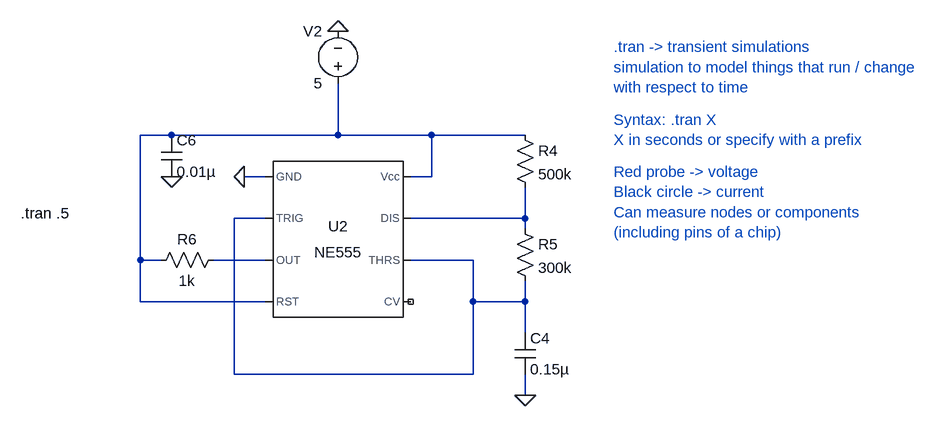
[diagram p0: schematic LTSPICE_Lesson4_Trans.asc]
LTSPICE_Lesson4_Trans.asc, the LTspice schematic file:
Version 4
SHEET 1 1600 680
WIRE -928 0 -976 0
WIRE -672 0 -672 -80
WIRE -672 0 -928 0
WIRE -528 0 -672 0
WIRE -384 0 -528 0
WIRE -784 64 -816 64
WIRE -528 64 -528 0
WIRE -528 64 -560 64
WIRE -784 128 -832 128
WIRE -384 128 -384 80
WIRE -384 128 -560 128
WIRE -384 144 -384 128
WIRE -976 192 -976 0
WIRE -944 192 -976 192
WIRE -784 192 -864 192
WIRE -464 192 -560 192
WIRE -976 256 -976 192
WIRE -784 256 -976 256
WIRE -464 256 -464 192
WIRE -384 256 -384 224
WIRE -384 256 -464 256
WIRE -384 304 -384 256
WIRE -832 368 -832 128
WIRE -464 368 -464 256
WIRE -464 368 -832 368
WIRE -384 400 -384 368
FLAG -816 64 0
FLAG -672 -160 0
FLAG -384 400 0
FLAG -928 64 0
SYMBOL Misc\\NE555 -672 160 R0
SYMATTR InstName U2
SYMBOL res -400 -16 R0
SYMATTR InstName R4
SYMATTR Value 500k
SYMBOL res -400 128 R0
SYMATTR InstName R5
SYMATTR Value 300k
SYMBOL res -848 176 R90
WINDOW 0 0 56 VBottom 2
WINDOW 3 32 56 VTop 2
SYMATTR InstName R6
SYMATTR Value 1k
SYMBOL cap -400 304 R0
SYMATTR InstName C4
SYMATTR Value 0.15µ
SYMBOL voltage -672 -64 R180
WINDOW 0 24 96 Left 2
WINDOW 3 24 16 Left 2
WINDOW 123 0 0 Left 0
WINDOW 39 0 0 Left 0
SYMATTR InstName V2
SYMATTR Value 5
SYMBOL cap -944 0 R0
SYMATTR InstName C6
SYMATTR Value 0.01µ
TEXT -248 -136 Left 2 ;.tran -> transient simulations \nsimulation to model things that run / change \nwith respect to time
TEXT -248 -24 Left 2 ;Syntax: .tran X \nX in seconds or specify with a prefix
TEXT -248 56 Left 2 ;Red probe -> voltage\nBlack circle -> current\nCan measure nodes or components\n(including pins of a chip)
TEXT -1160 120 Left 2 !.tran .5

The netlist it stands for:
* LTSPICE_Lesson4_Trans.asc
XU2 0 N002 N004 N001 NC_01 N002 N003 N001 NE555  ; pins GND TRIG OUT RST CV THRS DIS Vcc
R4 N001 N003 500k
R5 N003 N002 300k
R6 N004 N001 1k
C4 N002 0 0.15µ
V2 N001 0 5
C6 N001 0 0.01µ
* .tran -> transient simulations
* simulation to model things that run / change
* with respect to time
* Syntax: .tran X
* X in seconds or specify with a prefix
* Red probe -> voltage
* Black circle -> current
* Can measure nodes or components
* (including pins of a chip)
.tran .5
.lib NE555.sub
.backanno
.end